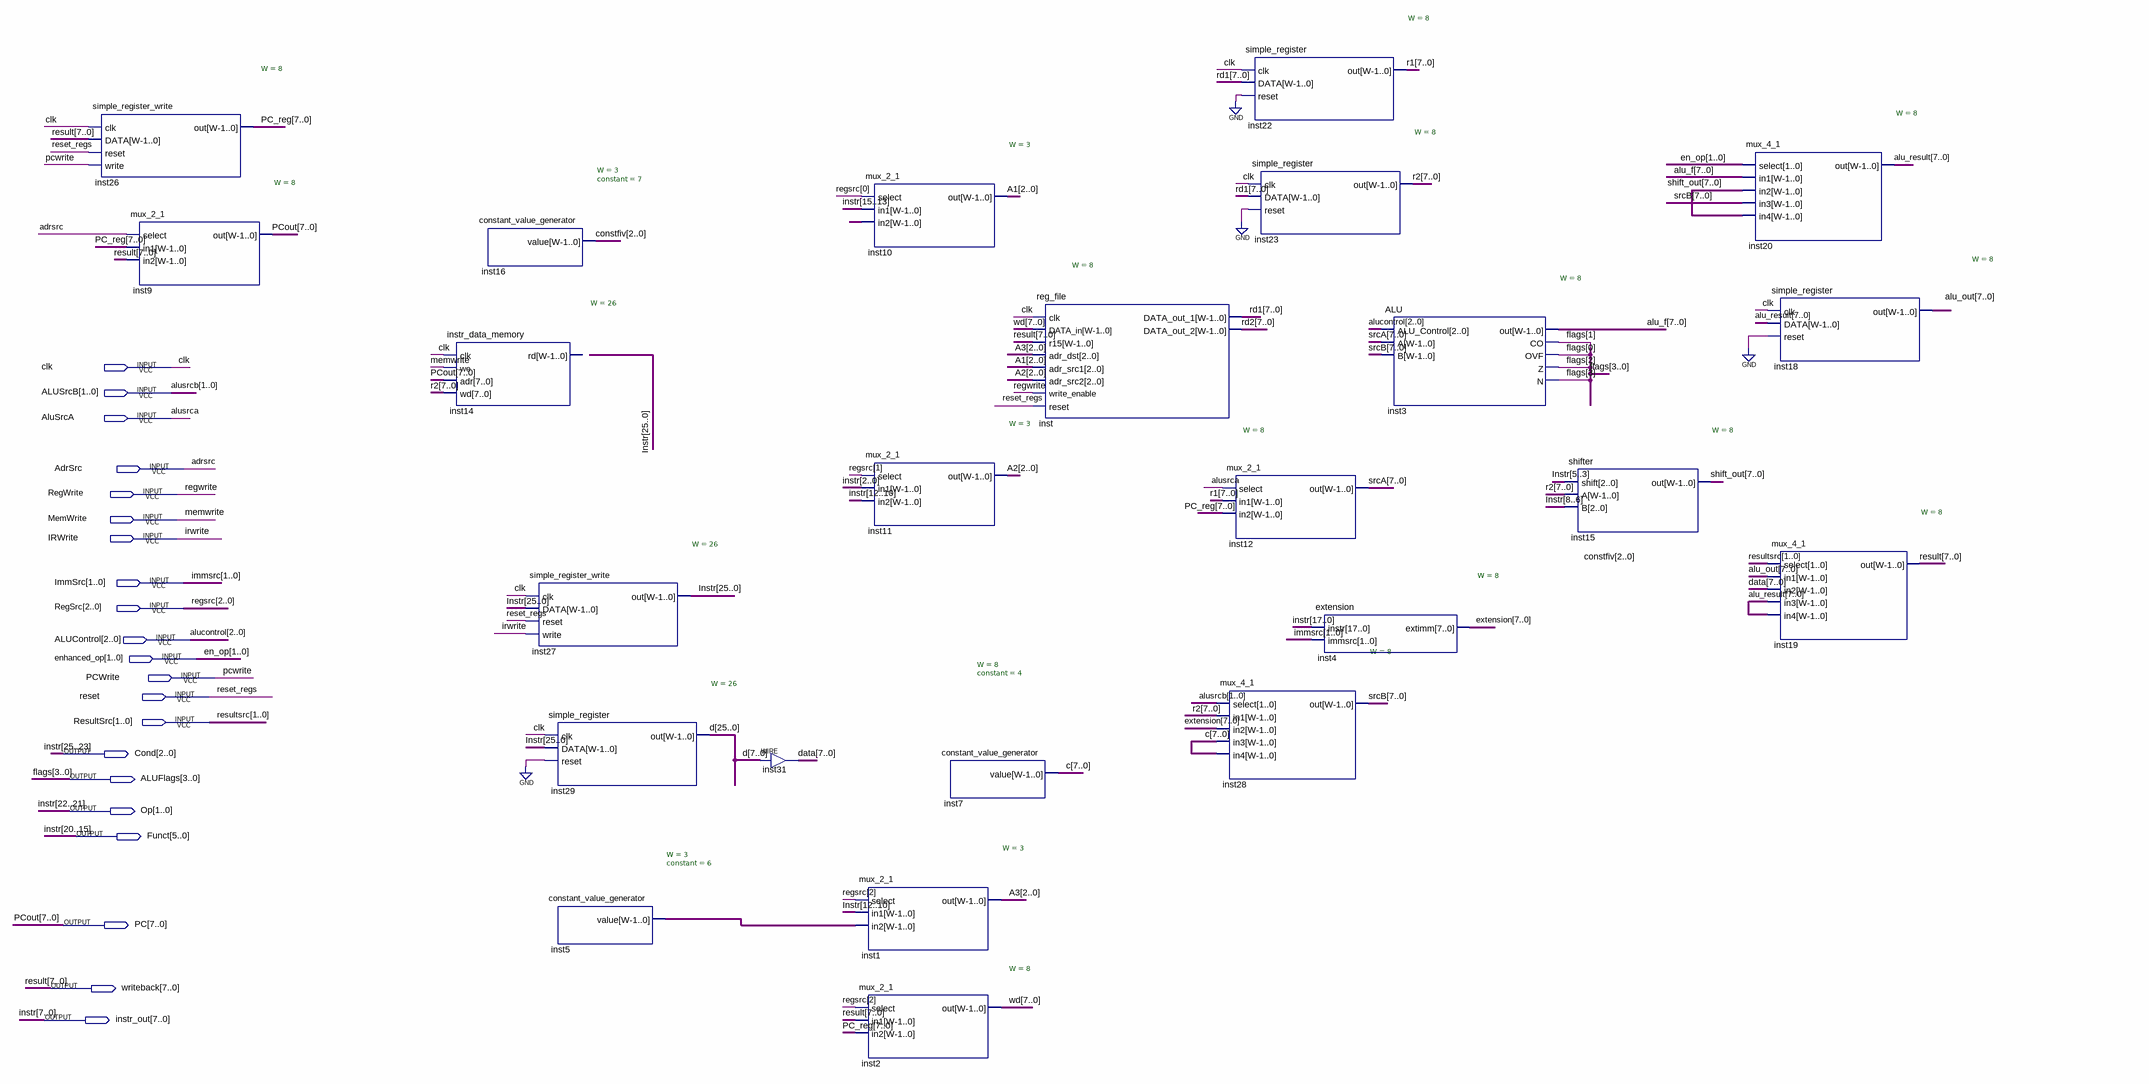
[diagram p0: schematic sheet]
// Quartus schematic datapath.bdf as structural Verilog: 24 symbols, 21 pins
module datapath (
  input  clk,
  input  [1:0] ALUSrcB,
  input  AluSrcA,
  input  AdrSrc,
  input  RegWrite,
  input  MemWrite,
  input  IRWrite,
  input  [1:0] ImmSrc,
  input  [2:0] RegSrc,
  input  [2:0] ALUControl,
  input  [1:0] enhanced_op,
  input  PCWrite,
  input  reset,
  input  [1:0] ResultSrc,
  output [2:0] Cond,
  output [3:0] ALUFlags,
  output [1:0] Op,
  output [5:0] Funct,
  output [7:0] PC,
  output [7:0] writeback,
  output [7:0] instr_out
);

  wire [2:0] A1, A2, A3, constfiv, inst5_value;
  wire [7:0] alu_f, alu_out, alu_result, c, data, extension, PC_reg, r1, r2, rd1, rd2, shift_out, srcA, srcB,
       wd;
  wire [14:8] instr;
  wire [25:0] d;

  simple_register_write #(.W(8)) inst26 (.clk(clk), .DATA(writeback), .reset(reset), .write(PCWrite), .out(PC_reg));
  mux_2_1 #(.W(8)) inst9 (.select(AdrSrc), .in1(PC_reg), .in2(writeback), .out(PC));
  instr_data_memory #(.W(26)) inst14 (.clk(clk), .we(MemWrite), .adr(PC), .wd(r2));  // open: rd
  constant_value_generator #(.W(3), .constant(7)) inst16 (.value(constfiv));
  simple_register_write #(.W(26)) inst27 (
    .clk(clk), .DATA({Cond, Op, Funct, instr, instr_out}), .reset(reset), .write(IRWrite),
    .out({Cond, Op, Funct, instr, instr_out}));
  simple_register #(.W(26)) inst29 (.clk(clk), .DATA({Cond, Op, Funct, instr, instr_out}), .reset(1'b0), .out(d));
  constant_value_generator #(.W(3), .constant(6)) inst5 (.value(inst5_value));
  assign data = d[7:0];  // WIRE inst31
  mux_2_1 #(.W(3)) inst1 (.select(RegSrc[2]), .in1(instr[12:10]), .in2(inst5_value), .out(A3));
  mux_2_1 #(.W(8)) inst2 (.select(RegSrc[2]), .in1(writeback), .in2(PC_reg), .out(wd));
  mux_2_1 #(.W(3)) inst10 (.select(RegSrc[0]), .in1({Funct[0], instr[14:13]}), .in2(constfiv), .out(A1));
  mux_2_1 #(.W(3)) inst11 (.select(RegSrc[1]), .in1(instr_out[2:0]), .in2(instr[12:10]), .out(A2));
  constant_value_generator #(.W(8), .constant(4)) inst7 (.value(c));
  reg_file #(.W(8)) inst (
    .clk(clk), .DATA_in(wd), .r15(writeback), .adr_dst(A3), .adr_src1(A1), .adr_src2(A2),
    .write_enable(RegWrite), .reset(reset), .DATA_out_1(rd1), .DATA_out_2(rd2));
  simple_register #(.W(8)) inst22 (.clk(clk), .DATA(rd1), .reset(1'b0), .out(r1));
  simple_register #(.W(8)) inst23 (.clk(clk), .DATA(rd1), .reset(1'b0), .out(r2));
  mux_2_1 #(.W(8)) inst12 (.select(AluSrcA), .in1(r1), .in2(PC_reg), .out(srcA));
  mux_4_1 #(.W(8)) inst28 (.select(ALUSrcB), .in1(r2), .in2(extension), .in3(c), .in4(c), .out(srcB));
  extension #(.W(8)) inst4 (.instr({Funct[2:0], instr, instr_out}), .immsrc(ImmSrc), .extimm(extension));
  ALU #(.W(8)) inst3 (
    .ALU_Control(ALUControl), .A(srcA), .B(srcB), .out(alu_f), .CO(ALUFlags[1]), .OVF(ALUFlags[0]),
    .Z(ALUFlags[2]), .N(ALUFlags[3]));
  shifter #(.W(8)) inst15 (.shift(instr_out[5:3]), .A(r2), .B({instr[8], instr_out[7:6]}), .out(shift_out));
  mux_4_1 #(.W(8)) inst20 (
    .select(enhanced_op), .in1(alu_f), .in2(shift_out), .in3(srcB), .in4(shift_out), .out(alu_result));
  simple_register #(.W(8)) inst18 (.clk(clk), .DATA(alu_result), .reset(1'b0), .out(alu_out));
  mux_4_1 #(.W(8)) inst19 (
    .select(ResultSrc), .in1(alu_out), .in2(data), .in3(alu_result), .in4(alu_result), .out(writeback));

  // Other names for the same wires on the sheet: en_op[1:0] = enhanced_op; flags[3:0] = ALUFlags;
  //   instr (some bits) = {Cond, Op, Funct, instr_out}; PCout[7:0] = PC; reset_regs = reset; result[7:0] = writeback
endmodule
